# EasyEDA schematic SCH_SER_Main_2021-08-20.json

## Sheets
1 Sheet_1: TITLE: Sheet_1; REV: 1.0; Date: 2021-08-10; Sheet: 1/1; Drawn By: Dako; Company: Your Company
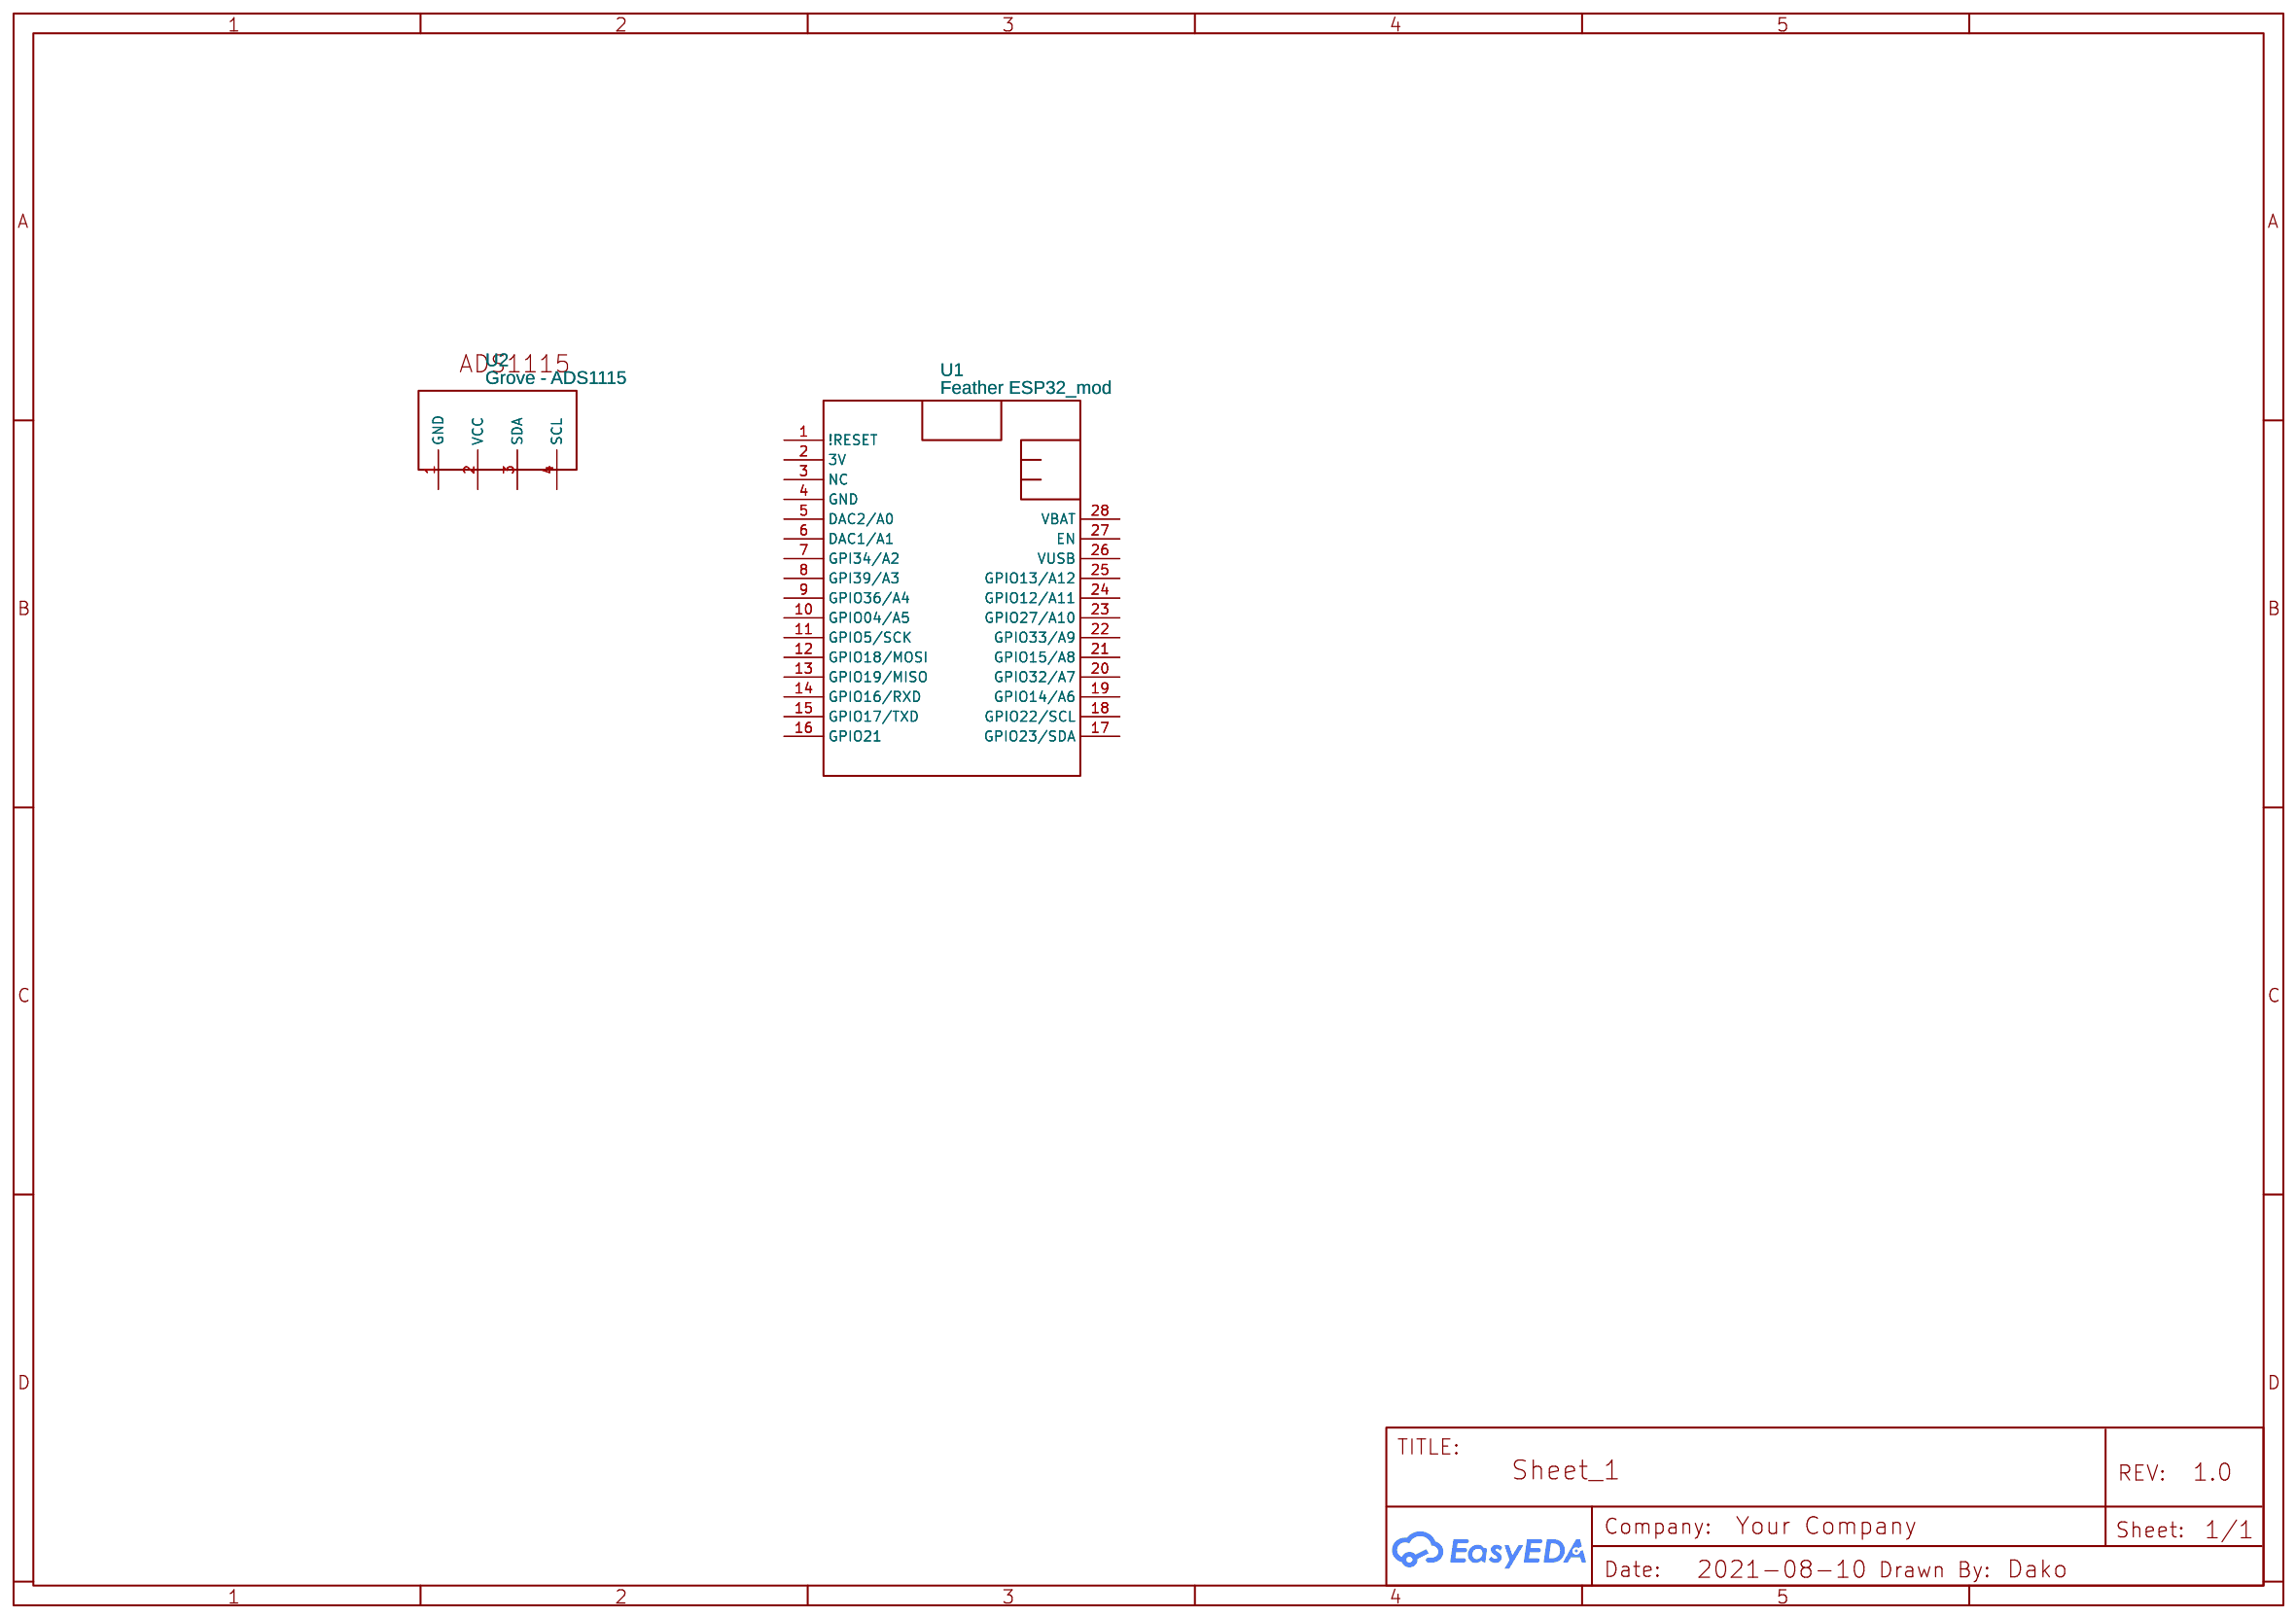
[diagram p0: Sheet_1]
2 electroCad/MainComputer
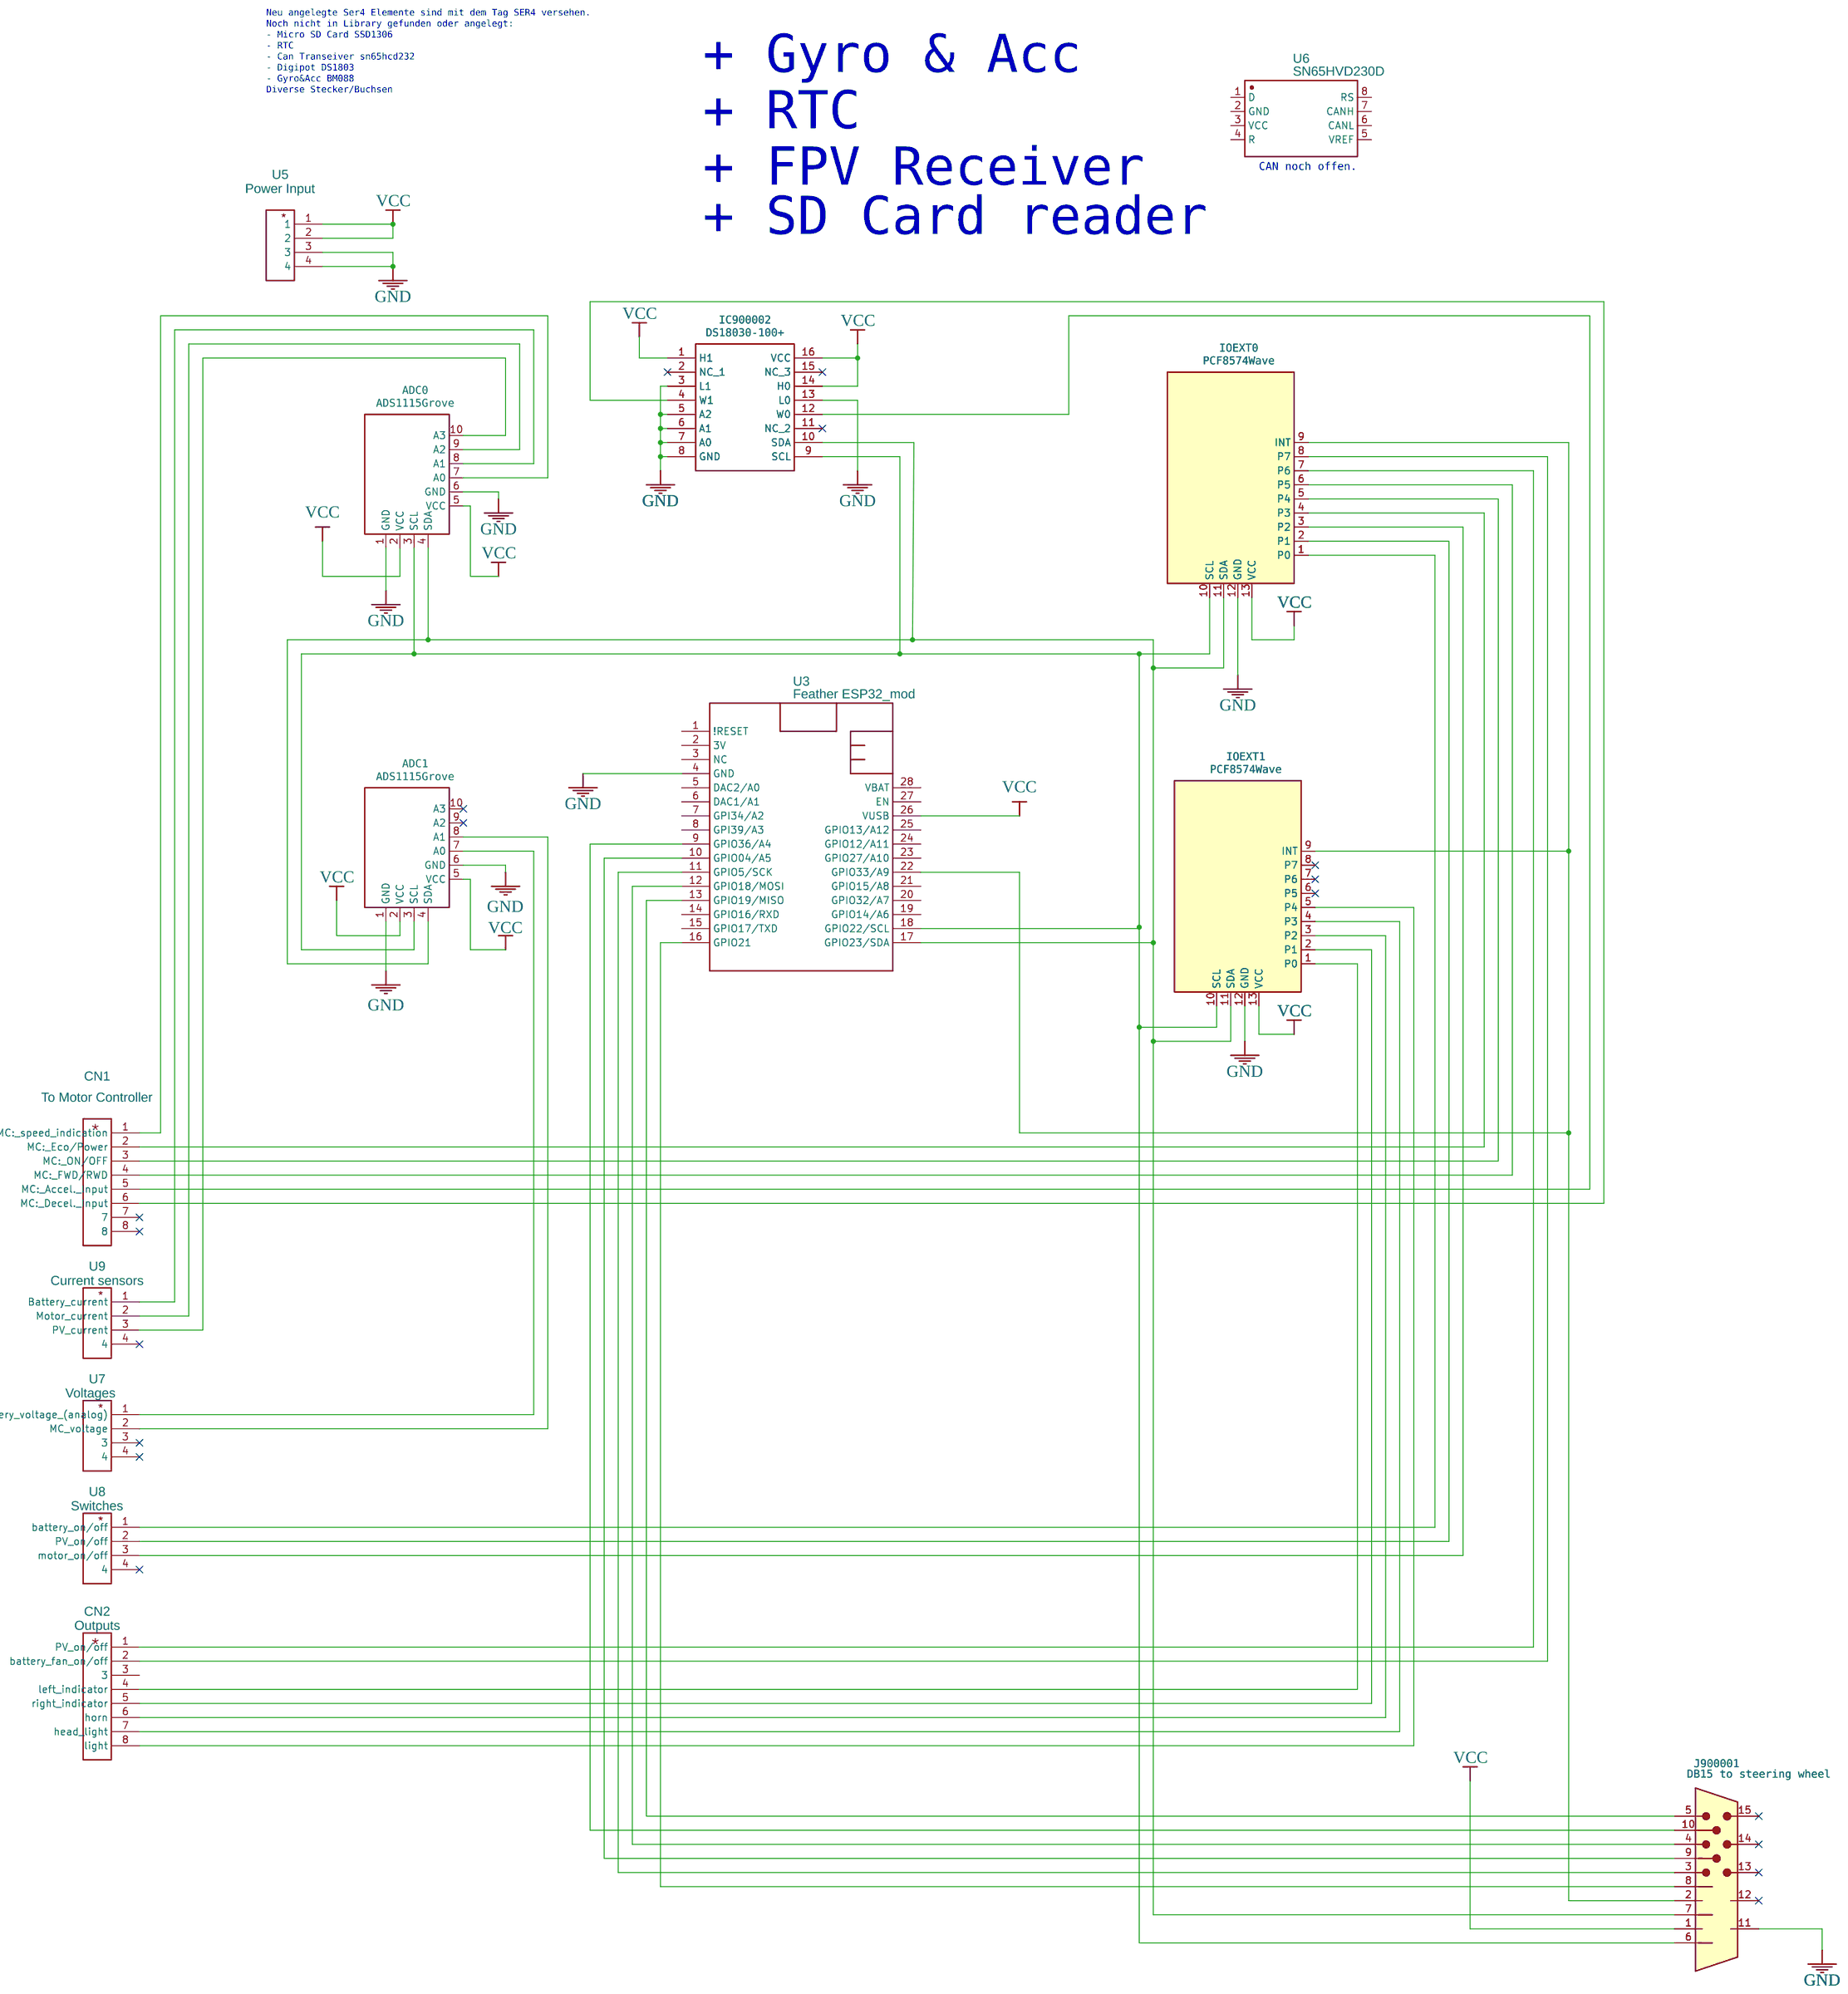
[diagram p1: electroCad/MainComputer]
3 electroCad/SteeringWheel
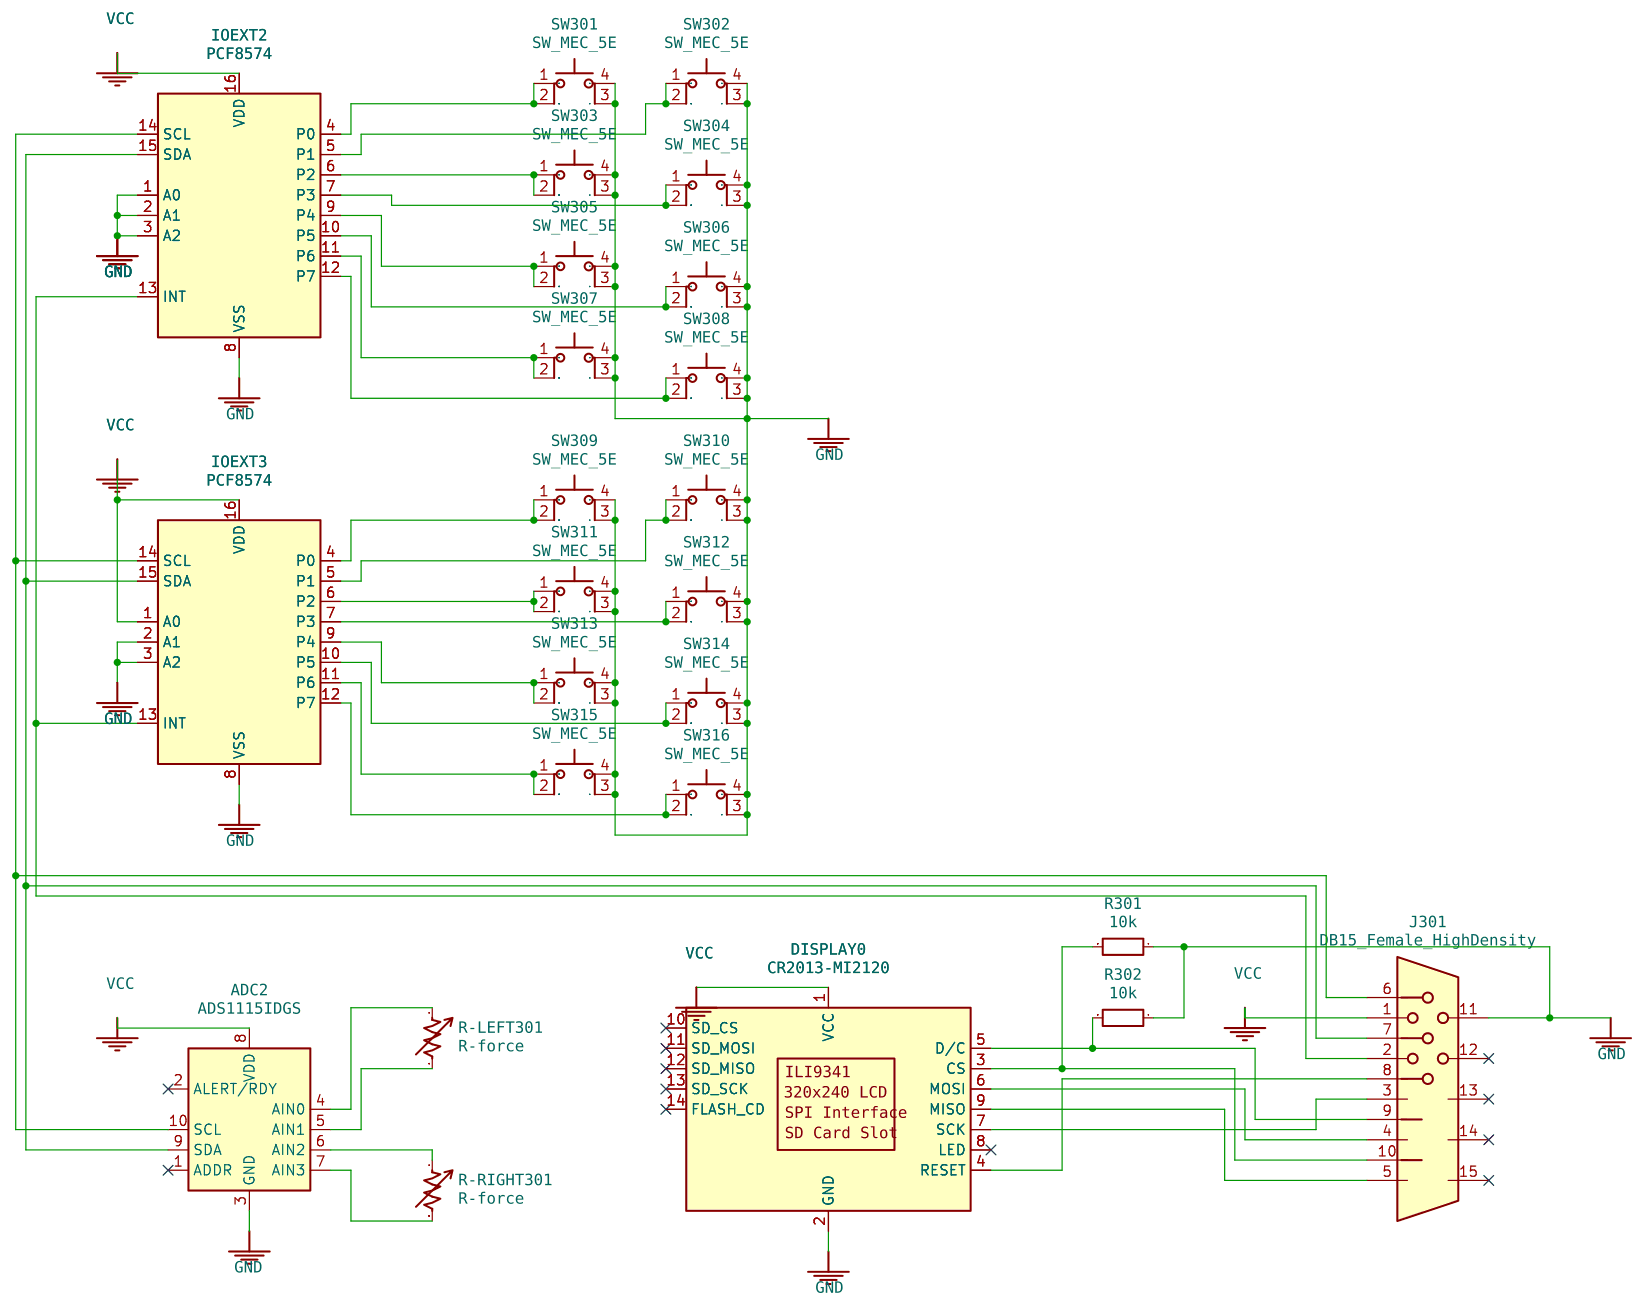
[diagram p2: electroCad/SteeringWheel]

## Parts
sheet electroCad/MainComputer
ADC0  ADS1115Grove  [ADS1115]
ADC1  ADS1115Grove  [ADS1115]
CN1  To Motor Controller  [HEADER_X8_P5.08_V1]
CN2  Outputs  [HEADER_X8_P5.08_V1]
IC?#2  DS18030-100+
IOEXT0  PCF8574Wave
IOEXT1  PCF8574Wave
J?#1  DB15 to steering wheel
U3  Feather ESP32_mod  [ADAFRUIT FEATHER ESP32]
U5  Power Input  [ECO SCREW TERMINAL 5.08MM 4P]
U6  SN65HVD230D  [SOIC-8]
U7  Voltages  [ECO SCREW TERMINAL 5.08MM 4P]
U8  Switches  [ECO SCREW TERMINAL 5.08MM 4P]
U9  Current sensors  [ECO SCREW TERMINAL 5.08MM 4P]
sheet electroCad/SteeringWheel
ADC2  ADS1115IDGS  [TSSOP-10_3X3MM_P0.5MM]
DISPLAY0  CR2013-MI2120  [CR2013-MI2120]
IOEXT2  PCF8574
IOEXT3  PCF8574
J301  DB15_Female_HighDensity
R301  10k
R302  10k
R-LEFT301  R-force
R-RIGHT301  R-force
SW301  SW_MEC_5E  [SW_MEC_5GTH9]
SW302  SW_MEC_5E  [SW_MEC_5GTH9]
SW303  SW_MEC_5E  [SW_MEC_5GTH9]
SW304  SW_MEC_5E  [SW_MEC_5GTH9]
SW305  SW_MEC_5E  [SW_MEC_5GTH9]
SW306  SW_MEC_5E  [SW_MEC_5GTH9]
SW307  SW_MEC_5E  [SW_MEC_5GTH9]
SW308  SW_MEC_5E  [SW_MEC_5GTH9]
SW309  SW_MEC_5E
SW310  SW_MEC_5E
SW311  SW_MEC_5E
SW312  SW_MEC_5E
SW313  SW_MEC_5E
SW314  SW_MEC_5E
SW315  SW_MEC_5E
SW316  SW_MEC_5E
sheet Sheet_1
U1  Feather ESP32_mod  [ADAFRUIT FEATHER ESP32]
U2  Grove - ADS1115  [GROVE_RS485]

## Library data of the parts
CN1 CN2 = CON_8P_5.08MM: Manufacturer Part: 10 Pin Screw Terminal 5.08mm; Supplier Part: 277-1248-ND?; Supplier: Digi-Key; link: https://www.digikey.com/product-detail/en/phoenix-contact/1729131/277-1248-ND/260616; Contributor: YK Chan
U1 U3 = Feather ESP32_mod: sourceId: 0S0UN5Zhz; Contributor: harrison18
U5 U7-U9 = SCREW TERMINAL 5.08MM 4P: Manufacturer Part: Screw Terminal 5.08mm 2P; Contributor: tbertoss
U6 = SN65HVD230D
ADC2 = -: Datasheet: http://www.ti.com/lit/ds/symlink/ads1113.pdf
DISPLAY0 = -: Datasheet: http://pan.baidu.com/s/11Y990
IOEXT2 IOEXT3 = -: Datasheet: http://www.nxp.com/documents/data_sheet/PCF8574_PCF8574A.pdf
SW301-SW316 = -: Datasheet: http://www.apem.com/int/index.php?controller=attachment&id_attachment=1371
U2 = Grove - RS485: Manufacturer: seeeds; Manufacturer Part: Grove RS485; Contributor: jk8770

## Nets
GND: ADC0.1(GND) ADC0.6(GND) ADC1.1(GND) ADC1.6(GND) ADC2.3(GND) DISPLAY0.2(GND) IC?#2.3(L1) IC?#2.5(A2) IC?#2.6(A1) IC?#2.7(A0) IC?#2.8(GND) IC?#2.13(L0) IOEXT0.12(GND) IOEXT1.12(GND) IOEXT2.1(A0) IOEXT2.2(A1) IOEXT2.3(A2) IOEXT2.8(VSS) IOEXT3.2(A1) IOEXT3.3(A2) IOEXT3.8(VSS) J301.11 J?#1.11 R301.1 R302.1 SW301.3(K) SW301.4(A) SW302.3(K) SW302.4(A) SW303.3(K) SW303.4(A) SW304.3(K) SW304.4(A) SW305.3(K) SW305.4(A) SW306.3(K) SW306.4(A) SW307.3(K) SW307.4(A) SW308.3(K) SW308.4(A) SW309.3(K) SW309.4(A) SW310.3(K) SW310.4(A) SW311.3(K) SW311.4(A) SW312.3(K) SW312.4(A) SW313.3(K) SW313.4(A) SW314.3(K) SW314.4(A) SW315.3(K) SW315.4(A) SW316.3(K) SW316.4(A) U3.4(GND) U5.3 U5.4
VCC: ADC0.2(VCC) ADC0.5(VCC) ADC1.2(VCC) ADC1.5(VCC) ADC2.8(VDD) DISPLAY0.1(VCC) IC?#2.1(H1) IC?#2.14(H0) IC?#2.16(VCC) IOEXT0.13(VCC) IOEXT1.13(VCC) IOEXT2.16(VDD) IOEXT3.1(A0) IOEXT3.16(VDD) J301.1 J?#1.1 U3.26(VUSB) U5.1 U5.2
Net-(ADC0-A0): ADC0.7(A0) CN1.1(MC:_speed_indication)
Net-(ADC0-A1): ADC0.8(A1) U9.1(Battery_current)
Net-(ADC0-A2): ADC0.9(A2) U9.2(Motor_current)
Net-(ADC0-A3): ADC0.10(A3) U9.3(PV_current)
Net-(ADC0-SCL): ADC0.3(SCL) ADC1.3(SCL) IC?#2.9(SCL) IOEXT0.10(SCL) IOEXT1.10(SCL) J?#1.6 U3.18(GPIO22/SCL)
Net-(ADC0-SDA): ADC0.4(SDA) ADC1.4(SDA) IC?#2.10(SDA) IOEXT0.11(SDA) IOEXT1.11(SDA) J?#1.7 U3.17(GPIO23/SDA)
Net-(ADC1-A0): ADC1.7(A0) U7.1(Battery_voltage_(analog))
Net-(ADC1-A1): ADC1.8(A1) U7.2(MC_voltage)
Net-(ADC2-AIN0): ADC2.4(AIN0) R-LEFT301.1
Net-(ADC2-AIN1): ADC2.5(AIN1) R-LEFT301.2
Net-(ADC2-AIN2): ADC2.6(AIN2) R-RIGHT301.1
Net-(ADC2-AIN3): ADC2.7(AIN3) R-RIGHT301.2
Net-(ADC2-SCL): ADC2.10(SCL) IOEXT2.14(SCL) IOEXT3.14(SCL) J301.6
Net-(ADC2-SDA): ADC2.9(SDA) IOEXT2.15(SDA) IOEXT3.15(SDA) J301.7
Net-(CN1-MC:_Accel._Input): CN1.5(MC:_Accel._Input) IC?#2.12(W0)
Net-(CN1-MC:_Decel._Input): CN1.6(MC:_Decel._Input) IC?#2.4(W1)
Net-(CN1-MC:_Eco/Power): CN1.2(MC:_Eco/Power) IOEXT0.4(P3)
Net-(CN1-MC:_FWD/RWD): CN1.4(MC:_FWD/RWD) IOEXT0.6(P5)
Net-(CN1-MC:_ON/OFF): CN1.3(MC:_ON/OFF) IOEXT0.5(P4)
Net-(CN2-battery_fan_on/off): CN2.2(battery_fan_on/off) IOEXT0.8(P7)
Net-(CN2-head_light): CN2.7(head_light) IOEXT1.4(P3)
Net-(CN2-horn): CN2.6(horn) IOEXT1.3(P2)
Net-(CN2-left_indicator): CN2.4(left_indicator) IOEXT1.1(P0)
Net-(CN2-light): CN2.8(light) IOEXT1.5(P4)
Net-(CN2-PV_on/off): CN2.1(PV_on/off) IOEXT0.7(P6)
Net-(CN2-right_indicator): CN2.5(right_indicator) IOEXT1.2(P1)
Net-(DISPLAY0-CS): DISPLAY0.3(CS) J301.10 R301.2
Net-(DISPLAY0-D/C): DISPLAY0.5(D/C) J301.9 R302.2
Net-(DISPLAY0-MISO): DISPLAY0.9(MISO) J301.5
Net-(DISPLAY0-MOSI): DISPLAY0.6(MOSI) J301.4
Net-(DISPLAY0-RESET): DISPLAY0.4(RESET) J301.8
Net-(DISPLAY0-SCK): DISPLAY0.7(SCK) J301.3
Net-(IOEXT0-INT): IOEXT0.9(INT) IOEXT1.9(INT) J?#1.2 U3.22(GPIO33/A9)
Net-(IOEXT0-P0): IOEXT0.1(P0) U8.1(battery_on/off)
Net-(IOEXT0-P1): IOEXT0.2(P1) U8.2(PV_on/off)
Net-(IOEXT0-P2): IOEXT0.3(P2) U8.3(motor_on/off)
Net-(IOEXT2-INT): IOEXT2.13(INT) IOEXT3.13(INT) J301.2
Net-(IOEXT2-P0): IOEXT2.4(P0) SW301.1 SW301.2
Net-(IOEXT2-P1): IOEXT2.5(P1) SW302.1 SW302.2
Net-(IOEXT2-P2): IOEXT2.6(P2) SW303.1 SW303.2
Net-(IOEXT2-P3): IOEXT2.7(P3) SW304.1 SW304.2
Net-(IOEXT2-P4): IOEXT2.9(P4) SW305.1 SW305.2
Net-(IOEXT2-P5): IOEXT2.10(P5) SW306.1 SW306.2
Net-(IOEXT2-P6): IOEXT2.11(P6) SW307.1 SW307.2
Net-(IOEXT2-P7): IOEXT2.12(P7) SW308.1 SW308.2
Net-(IOEXT3-P0): IOEXT3.4(P0) SW309.1 SW309.2
Net-(IOEXT3-P1): IOEXT3.5(P1) SW310.1 SW310.2
Net-(IOEXT3-P2): IOEXT3.6(P2) SW311.1 SW311.2
Net-(IOEXT3-P3): IOEXT3.7(P3) SW312.1 SW312.2
Net-(IOEXT3-P4): IOEXT3.9(P4) SW313.1 SW313.2
Net-(IOEXT3-P5): IOEXT3.10(P5) SW314.1 SW314.2
Net-(IOEXT3-P6): IOEXT3.11(P6) SW315.1 SW315.2
Net-(IOEXT3-P7): IOEXT3.12(P7) SW316.1 SW316.2
Net-(U3-GPIO04/A5): J?#1.9 U3.10(GPIO04/A5)
Net-(U3-GPIO5/SCK): J?#1.3 U3.11(GPIO5/SCK)
Net-(U3-GPIO18/MOSI): J?#1.4 U3.12(GPIO18/MOSI)
Net-(U3-GPIO19/MISO): J?#1.5 U3.13(GPIO19/MISO)
Net-(U3-GPIO21): J?#1.8 U3.16(GPIO21)
Net-(U3-GPIO36/A4): J?#1.10 U3.9(GPIO36/A4)

Not connected (* = marked no-connect by the designer): ADC1 9(A2)* 10(A3)*; ADC2 1(ADDR)* 2(ALERT/RDY)*; CN1 7* 8*; CN2 3; DISPLAY0 8(LED)* 10(SD_CS)* 11(SD_MOSI)* 12(SD_MISO)* 13(SD_SCK)* 14(FLASH_CD)*; IC?#2 2(NC_1)* 11(NC_2)* 15(NC_3)*; IOEXT1 6(P5)* 7(P6)* 8(P7)*; J301 12* 13* 14* 15*; J?#1 12* 13* 14* 15*; U1 1(!RESET) 2(3V) 3(NC) 4(GND) 5(DAC2/A0) 6(DAC1/A1) 7(GPI34/A2) 8(GPI39/A3) 9(GPIO36/A4) 10(GPIO04/A5) 11(GPIO5/SCK) 12(GPIO18/MOSI) 13(GPIO19/MISO) 14(GPIO16/RXD) 15(GPIO17/TXD) 16(GPIO21) 17(GPIO23/SDA) 18(GPIO22/SCL) 19(GPIO14/A6) 20(GPIO32/A7) 21(GPIO15/A8) 22(GPIO33/A9) 23(GPIO27/A10) 24(GPIO12/A11) 25(GPIO13/A12) 26(VUSB) 27(EN) 28(VBAT); U2 1(GND) 2(VCC) 3(SDA) 4(SCL); U3 1(!RESET) 2(3V) 3(NC) 5(DAC2/A0) 6(DAC1/A1) 7(GPI34/A2) 8(GPI39/A3) 14(GPIO16/RXD) 15(GPIO17/TXD) 19(GPIO14/A6) 20(GPIO32/A7) 21(GPIO15/A8) 23(GPIO27/A10) 24(GPIO12/A11) 25(GPIO13/A12) 27(EN) 28(VBAT); U6 1(D) 2(GND) 3(VCC) 4(R) 5(VREF) 6(CANL) 7(CANH) 8(RS); U7 3* 4*; U8 4*; U9 4*

## Notes on the sheets
sheet 2
- Neu angelegte Ser4 Elemente sind mit dem Tag SER4 versehen.
  Noch nicht in Library gefunden oder angelegt:
  - Micro SD Card SSD1306
  - RTC
  - Can Transeiver sn65hcd232
  - Digipot DS1803
  - Gyro&Acc BM088
  Diverse Stecker/Buchsen
- + Gyro & Acc
- + RTC
- + FPV Receiver
- CAN noch offen.
- + SD Card reader
